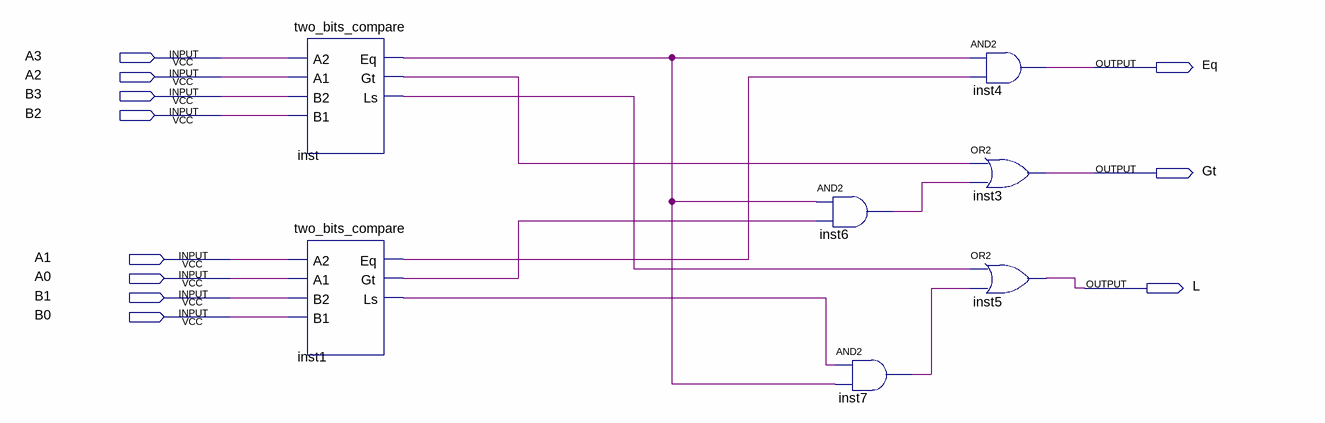
[diagram p0: schematic sheet]
// Quartus schematic week3_3.bdf as structural Verilog: 7 symbols, 11 pins
module week3_3 (
  input  A3,
  input  A2,
  input  B3,
  input  B2,
  input  A1,
  input  A0,
  input  B1,
  input  B0,
  output Eq,
  output Gt,
  output L
);

  wire inst1_eq, inst1_gt, inst1_ls, inst6_out, inst7_out, inst_eq, inst_gt, inst_ls;

  two_bits_compare inst (.A2(A3), .A1(A2), .B2(B3), .B1(B2), .Eq(inst_eq), .Gt(inst_gt), .Ls(inst_ls));
  two_bits_compare inst1 (.A2(A1), .A1(A0), .B2(B1), .B1(B0), .Eq(inst1_eq), .Gt(inst1_gt), .Ls(inst1_ls));
  and inst6 (inst6_out, inst_eq, inst1_gt);
  and inst7 (inst7_out, inst1_ls, inst_eq);
  and inst4 (Eq, inst_eq, inst1_eq);
  or inst3 (Gt, inst_gt, inst6_out);
  or inst5 (L, inst_ls, inst7_out);
endmodule
